# Altium schematic sheet Output_block.SchDoc
size A4
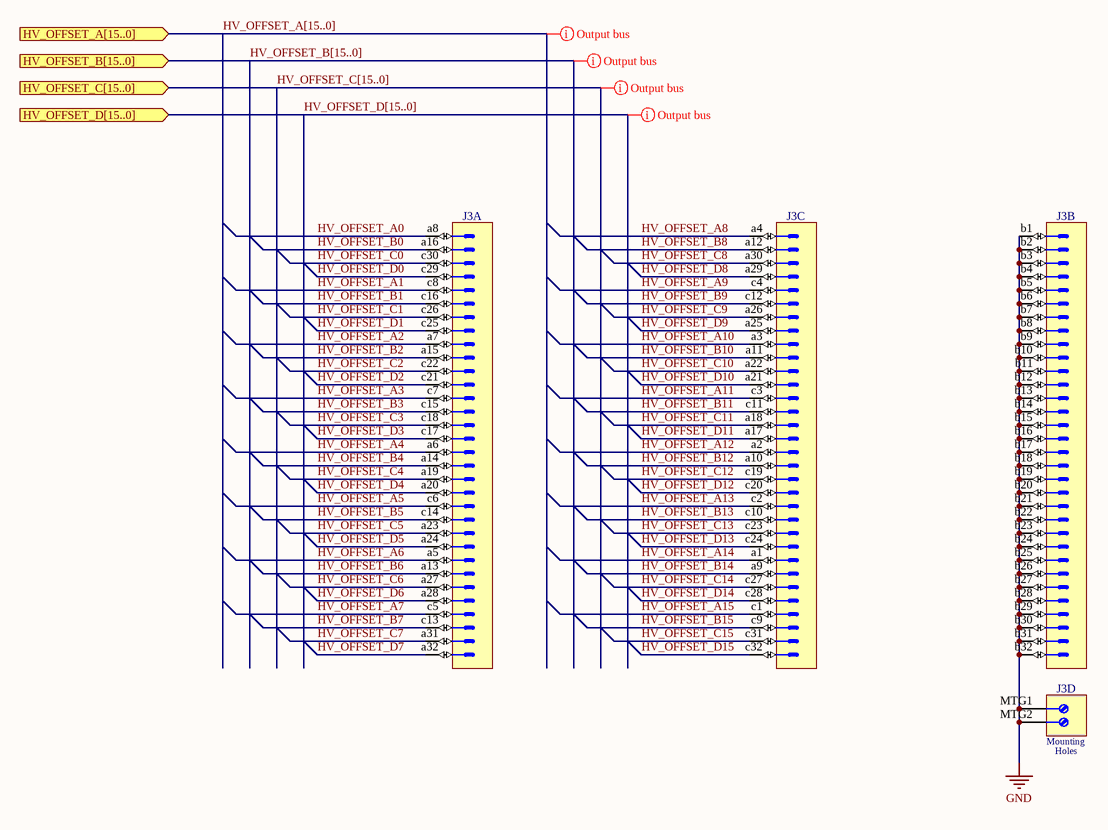
[diagram p0: Output_block.SchDoc]

## Parts
J3  DIN 41612 Type C  [HARTING_09 03 696 6921]  (value not drawn)  (parts A,B,C,D of 4)

## Ports
HV_OFFSET_A[15..0] (in), HV_OFFSET_B[15..0] (in), HV_OFFSET_C[15..0] (in), HV_OFFSET_D[15..0] (in)

## Nets
GND: J3.b1 J3.b2 J3.b3 J3.b4 J3.b5 J3.b6 J3.b7 J3.b8 J3.b9 J3.b10 J3.b11 J3.b12 J3.b13 J3.b14 J3.b15 J3.b16 J3.b17 J3.b18 J3.b19 J3.b20 J3.b21 J3.b22 J3.b23 J3.b24 J3.b25 J3.b26 J3.b27 J3.b28 J3.b29 J3.b30 J3.b31 J3.b32 J3.MTG1 J3.MTG2
HV_OFFSET_A0: J3.a8
HV_OFFSET_A1: J3.c8
HV_OFFSET_A2: J3.a7
HV_OFFSET_A3: J3.c7
HV_OFFSET_A4: J3.a6
HV_OFFSET_A5: J3.c6
HV_OFFSET_A6: J3.a5
HV_OFFSET_A7: J3.c5
HV_OFFSET_A8: J3.a4
HV_OFFSET_A9: J3.c4
HV_OFFSET_A10: J3.a3
HV_OFFSET_A11: J3.c3
HV_OFFSET_A12: J3.a2
HV_OFFSET_A13: J3.c2
HV_OFFSET_A14: J3.a1
HV_OFFSET_A15: J3.c1
HV_OFFSET_B0: J3.a16
HV_OFFSET_B1: J3.c16
HV_OFFSET_B2: J3.a15
HV_OFFSET_B3: J3.c15
HV_OFFSET_B4: J3.a14
HV_OFFSET_B5: J3.c14
HV_OFFSET_B6: J3.a13
HV_OFFSET_B7: J3.c13
HV_OFFSET_B8: J3.a12
HV_OFFSET_B9: J3.c12
HV_OFFSET_B10: J3.a11
HV_OFFSET_B11: J3.c11
HV_OFFSET_B12: J3.a10
HV_OFFSET_B13: J3.c10
HV_OFFSET_B14: J3.a9
HV_OFFSET_B15: J3.c9
HV_OFFSET_C0: J3.c30
HV_OFFSET_C1: J3.c26
HV_OFFSET_C2: J3.c22
HV_OFFSET_C3: J3.c18
HV_OFFSET_C4: J3.a19
HV_OFFSET_C5: J3.a23
HV_OFFSET_C6: J3.a27
HV_OFFSET_C7: J3.a31
HV_OFFSET_C8: J3.a30
HV_OFFSET_C9: J3.a26
HV_OFFSET_C10: J3.a22
HV_OFFSET_C11: J3.a18
HV_OFFSET_C12: J3.c19
HV_OFFSET_C13: J3.c23
HV_OFFSET_C14: J3.c27
HV_OFFSET_C15: J3.c31
HV_OFFSET_D0: J3.c29
HV_OFFSET_D1: J3.c25
HV_OFFSET_D2: J3.c21
HV_OFFSET_D3: J3.c17
HV_OFFSET_D4: J3.a20
HV_OFFSET_D5: J3.a24
HV_OFFSET_D6: J3.a28
HV_OFFSET_D7: J3.a32
HV_OFFSET_D8: J3.a29
HV_OFFSET_D9: J3.a25
HV_OFFSET_D10: J3.a21
HV_OFFSET_D11: J3.a17
HV_OFFSET_D12: J3.c20
HV_OFFSET_D13: J3.c24
HV_OFFSET_D14: J3.c28
HV_OFFSET_D15: J3.c32

## Buses and harness runs
bus HV_OFFSET_A[15..0] = port HV_OFFSET_A[15..0]
bus HV_OFFSET_B[15..0] = port HV_OFFSET_B[15..0]
bus HV_OFFSET_C[15..0] = port HV_OFFSET_C[15..0]
bus HV_OFFSET_D[15..0] = port HV_OFFSET_D[15..0]

## Layout directives
mark named Output bus: (no net found under the mark)

## Notes on the sheet
- (in symbol HARTING_09 03 696 6921, part D) Mounting; Holes

## Library data of the parts
J3 = HARTING_09 03 696 6921: Connector 96abc male (3x32); Part Description: DIN 41612, Type C, Thru-Hole;  Rows a+b+c, 96 Position, Performance level 2, Lead 3.0 mm, Pitch 2.54mm, Right Angle Male Connector With Coding; PressFit: No; Part Number: HARTING_09 03 696 6921; Component Kind: Standard; Component Type: Standard; Pin Count: 98; Family: DIN 41612 Type C; Mounted: Yes; Socket: No; SMD: No; Sense: No; Status: None; Manufacturer: HARTING; Manufacturer Part Number: 09 03 696 6921; ComponentHeight: 13.1mm; HelpURL: \\cern.ch\dfs\Applications\Altium\Datasheets\HARTING_09 03 696 6921.pdf; Author: CERN DEM JLC; CreateDate: 30.03.2011; LatestRevisionDate: 30.03.2011